# EAGLE design Dig (EAGLE 9.5.1)

## Sheet 1 of 2
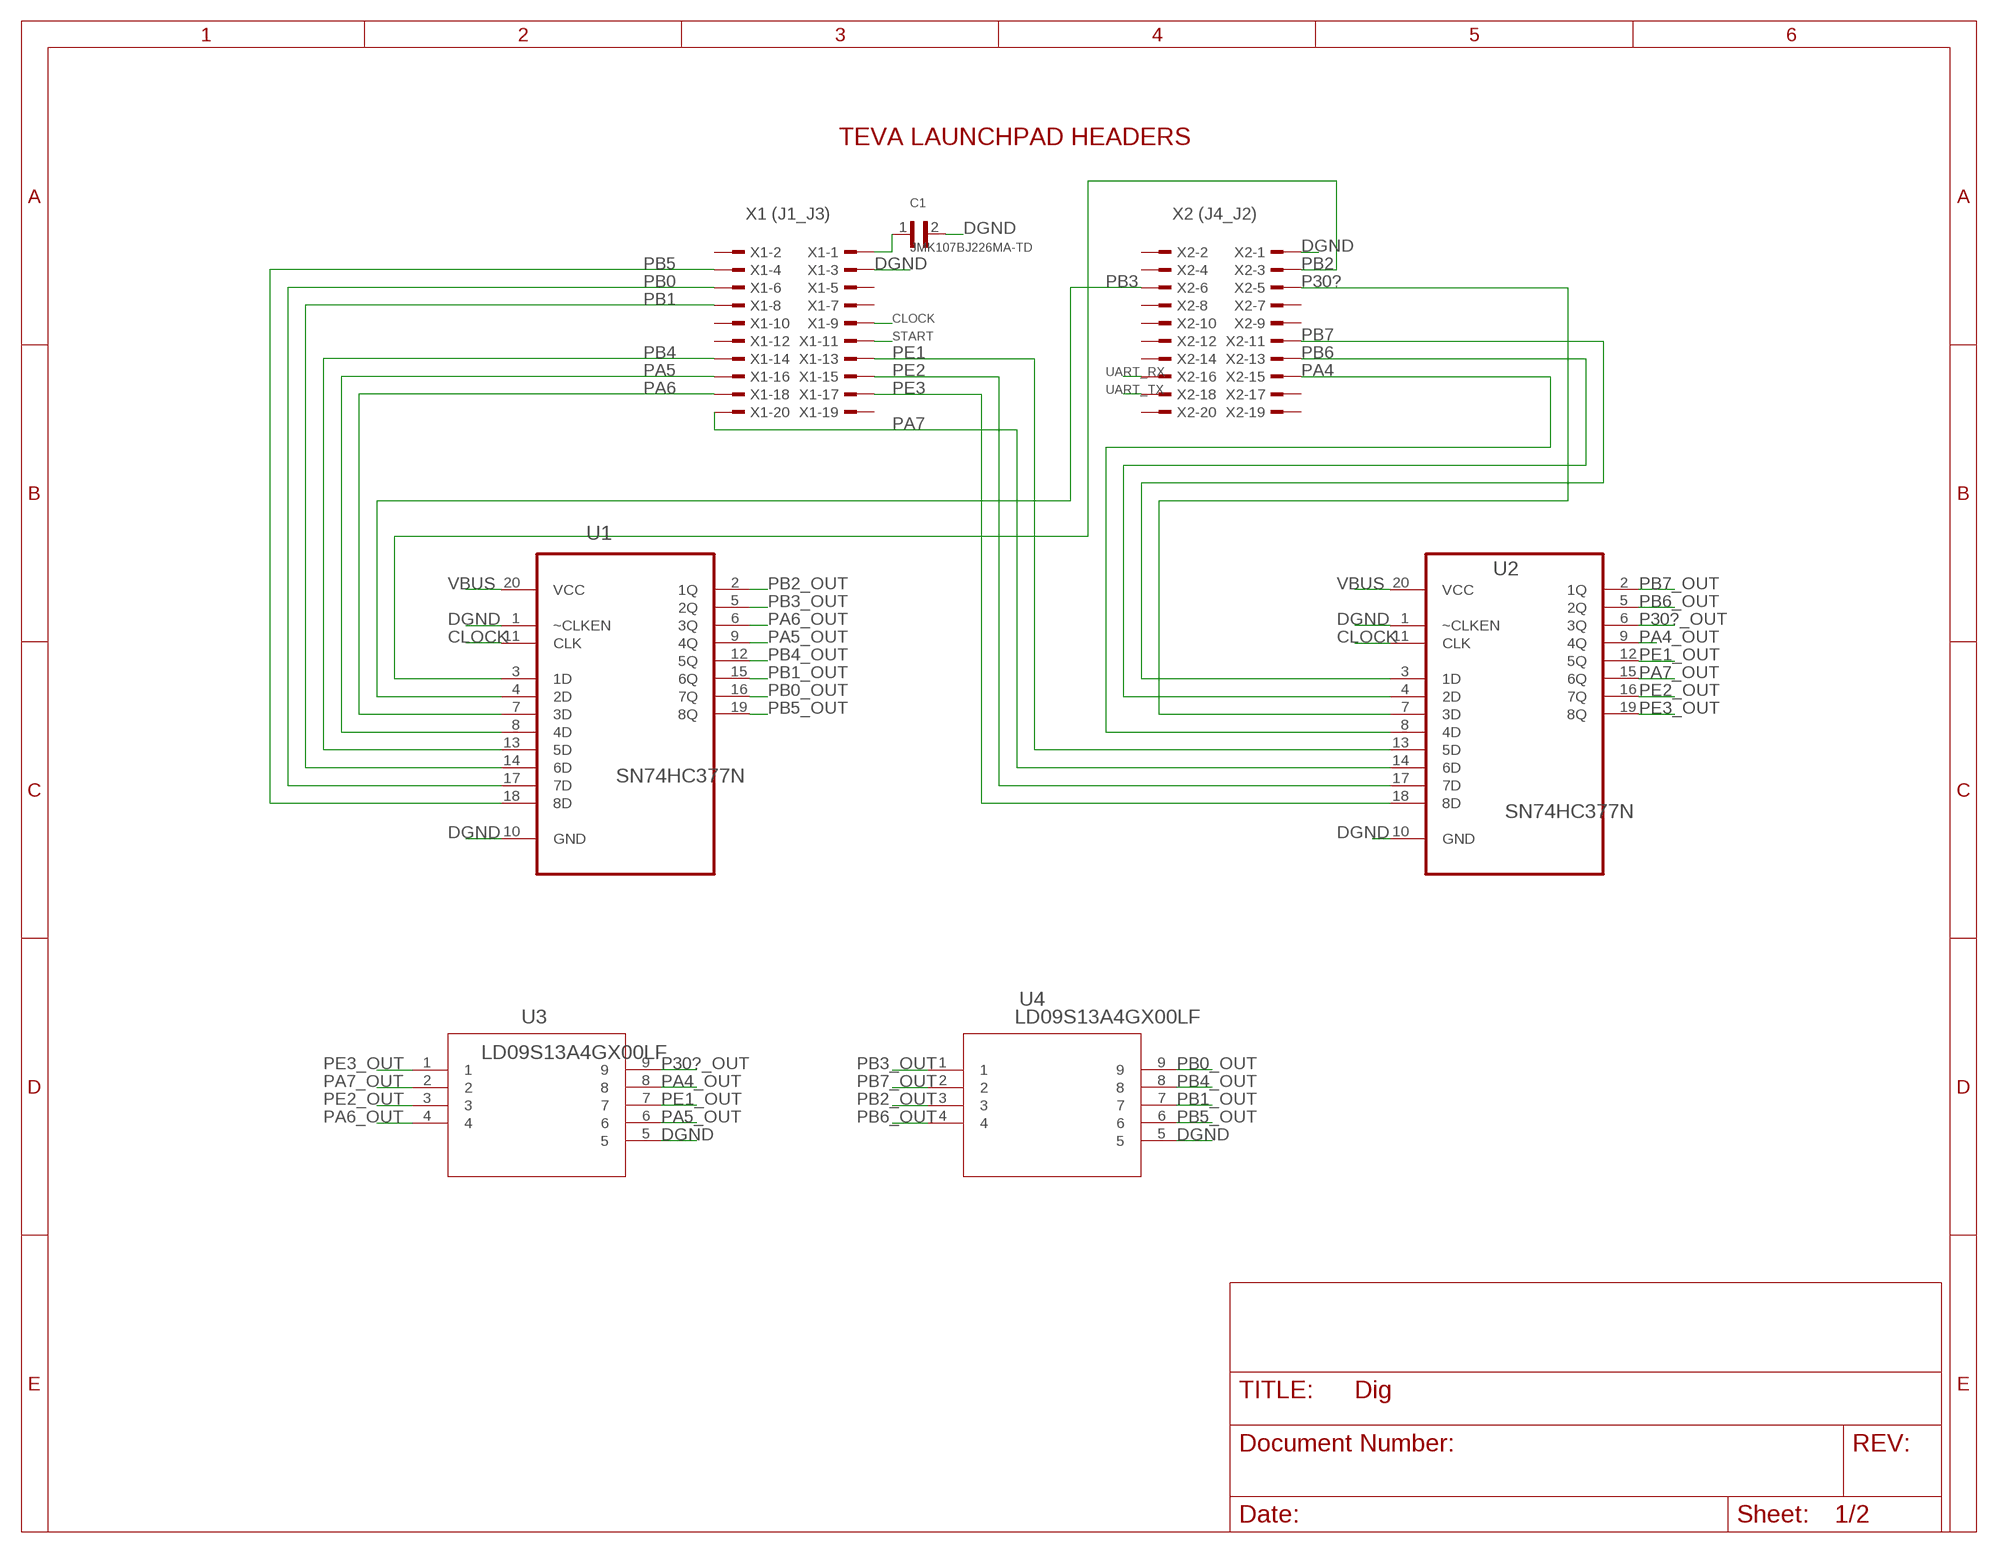
[diagram p0: schematic, sheet 1]

### Parts
C1  JMK107BJ226MA-TD  [CAPC1608X90N]
U1  SN74HC377N  [DIP254P762X508-20]
U2  SN74HC377N  [DIP254P762X508-20]
U3  LD09S13A4GX00LF  [LD09S13A4GX00LF_AMP]
U4  LD09S13A4GX00LF  [LD09S13A4GX00LF_AMP]
X1  X1 (J1_J3)  TSW-110-07-G-D  [TSW-110-XX-G-D]
X2  X2 (J4_J2)  TSW-110-07-G-D  [TSW-110-XX-G-D]

### Nets
CLOCK: U1.11(CLK) U2.11(CLK) X1.9
DGND: C1.2 U1.1(~CLKEN) U1.10(GND) U2.1(~CLKEN) U2.10(GND) U3.5 U4.5 X1.3 X2.1
P30?: U2.7(3D) X2.5
P30?_OUT: U2.6(3Q) U3.9
PA4: U2.8(4D) X2.15
PA4_OUT: U2.9(4Q) U3.8
PA5: U1.8(4D) X1.16
PA5_OUT: U1.9(4Q) U3.6
PA6: U1.7(3D) X1.18
PA6_OUT: U1.6(3Q) U3.4
PA7: U2.14(6D) X1.20
PA7_OUT: U2.15(6Q) U3.2
PB0: U1.17(7D) X1.6
PB0_OUT: U1.16(7Q) U4.9
PB1: U1.14(6D) X1.8
PB1_OUT: U1.15(6Q) U4.7
PB2: U1.3(1D) X2.3
PB2_OUT: U1.2(1Q) U4.3
PB3: U1.4(2D) X2.6
PB3_OUT: U1.5(2Q) U4.1
PB4: U1.13(5D) X1.14
PB4_OUT: U1.12(5Q) U4.8
PB5: U1.18(8D) X1.4
PB5_OUT: U1.19(8Q) U4.6
PB6: U2.4(2D) X2.13
PB6_OUT: U2.5(2Q) U4.4
PB7: U2.3(1D) X2.11
PB7_OUT: U2.2(1Q) U4.2
PE1: U2.13(5D) X1.13
PE1_OUT: U2.12(5Q) U3.7
PE2: U2.17(7D) X1.15
PE2_OUT: U2.16(7Q) U3.3
PE3: U2.18(8D) X1.17
PE3_OUT: U2.19(8Q) U3.1
START: X1.11
UART_RX: X2.16
UART_TX: X2.18
VBUS: C1.1 U1.20(VCC) U2.20(VCC) X1.1
Unconnected: X1.2 X1.5 X1.7 X1.10 X1.12 X1.19 X2.2 X2.4 X2.7 X2.8 X2.9 X2.10 X2.12 X2.14 X2.17 X2.19 X2.20

### Notes on the sheet
- TEVA LAUNCHPAD HEADERS

## Sheet 2 of 2
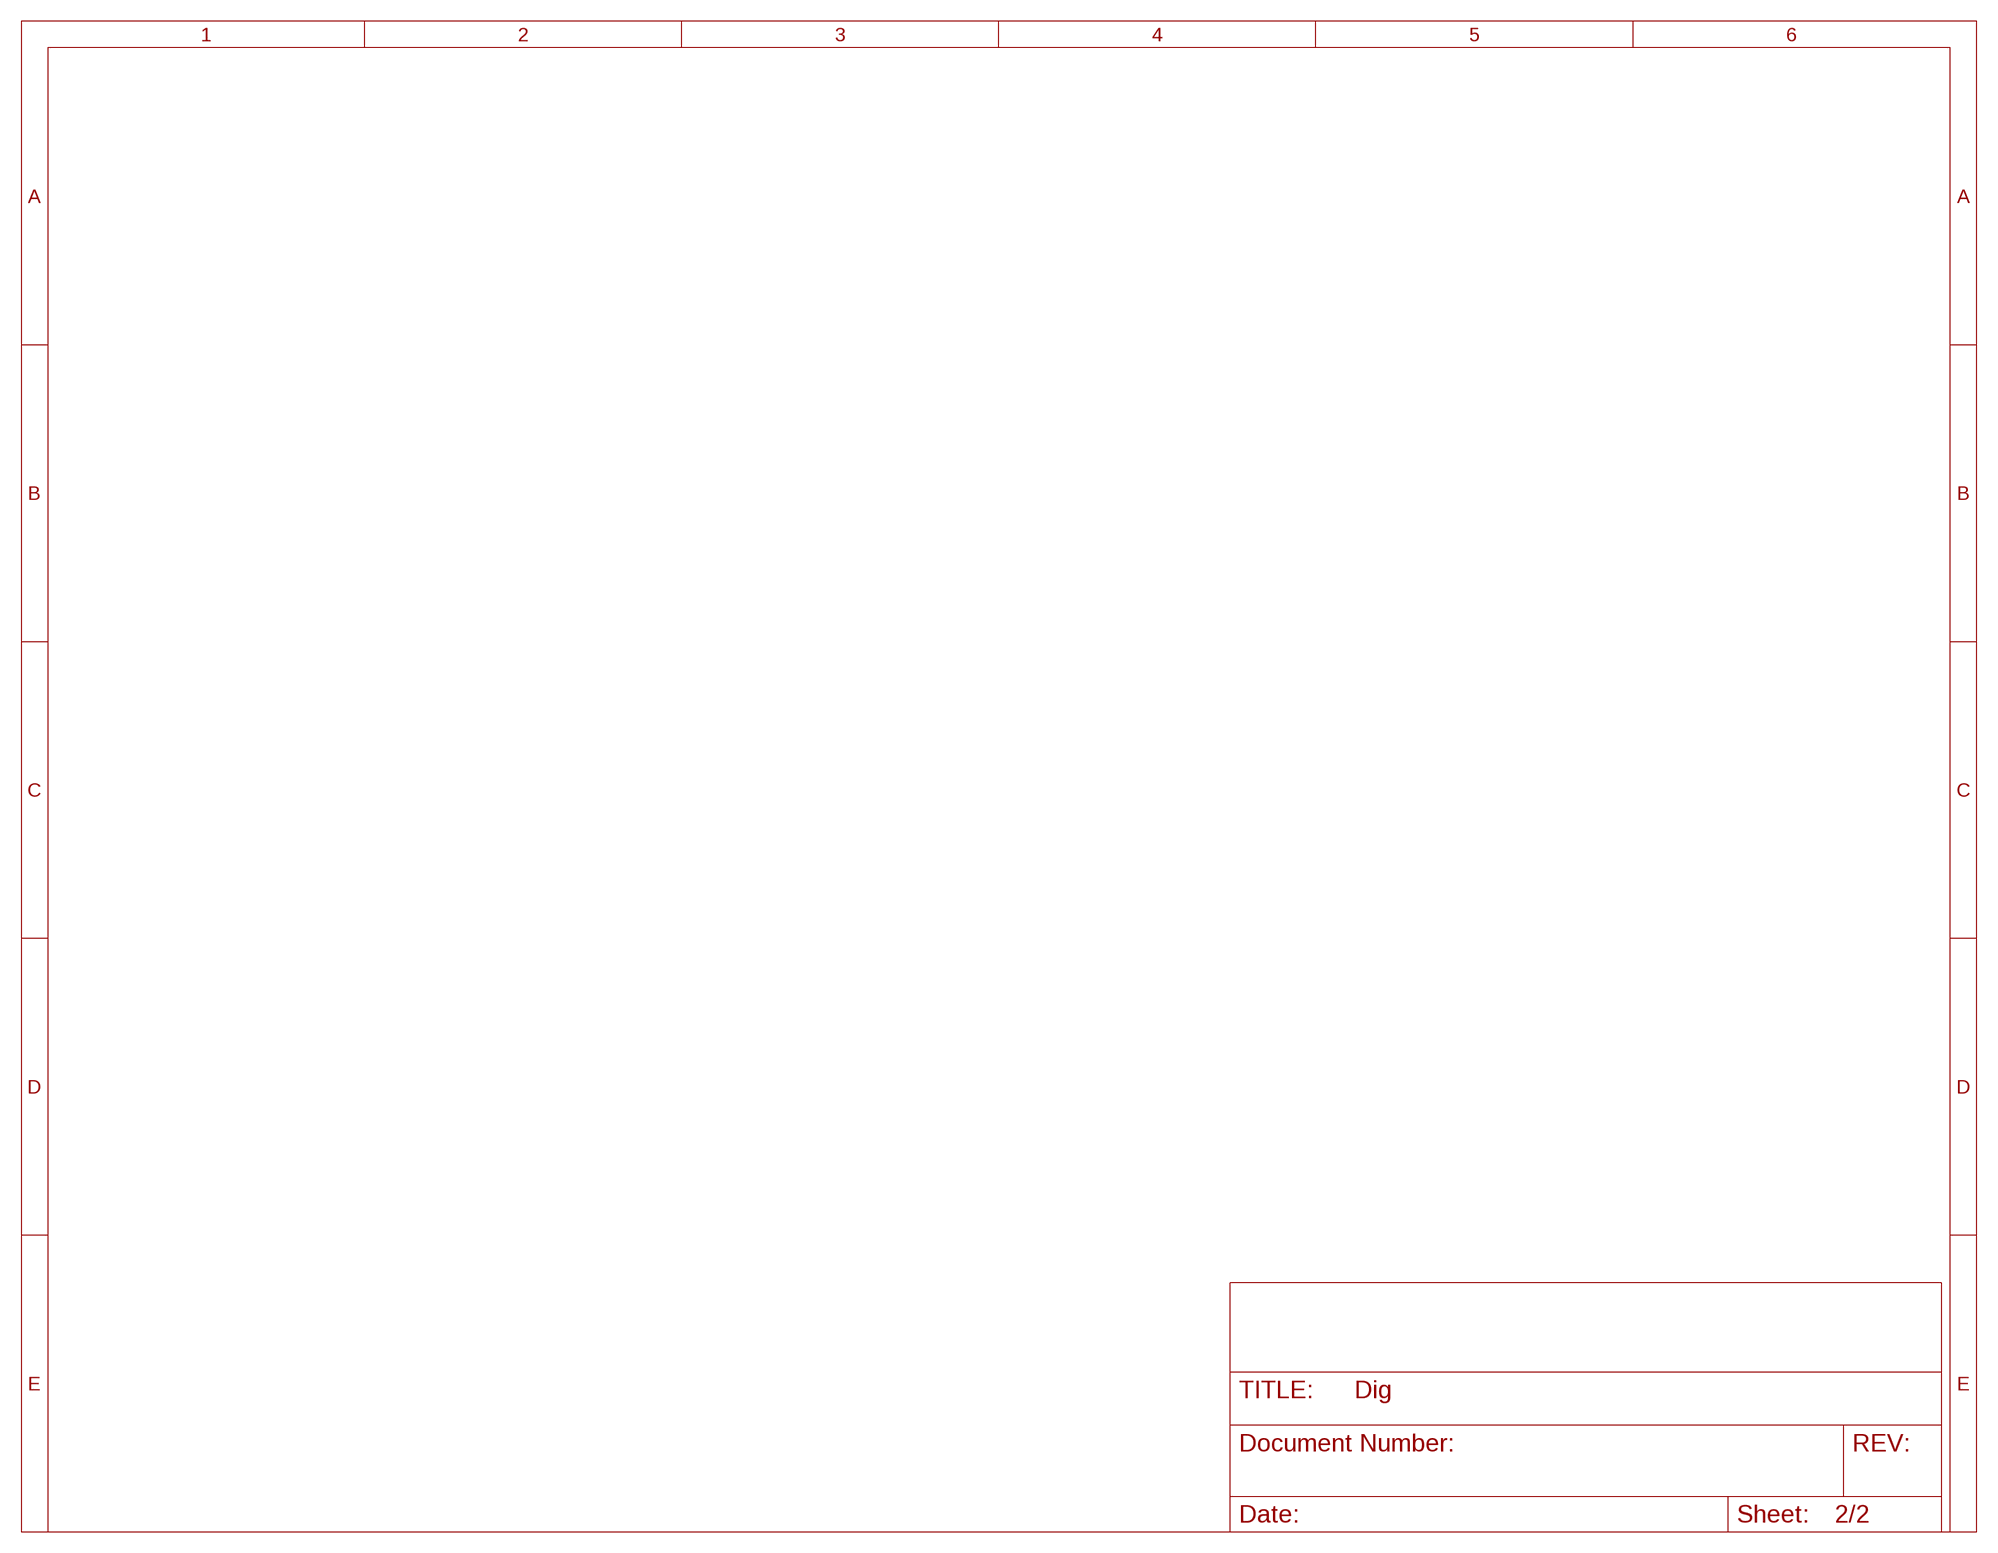
[diagram p1: schematic, sheet 2]

## Library data of the parts
C1 = 22muF_cap_0603:JMK107BJ226MA-TD: CAP CER 22UF 6.3V X5R 0603; DESCRIPTION: 22µF ±20% 6.3V Ceramic Capacitor X5R 0603 (1608 Metric); DIGI-KEY_PART_NUMBER: 587-6144-1-ND; MF: Taiyo Yuden; MP: JMK107BJ226MA-TD; PACKAGE: 1608 Taiyo Yuden
U1 = SN74HC377N:SN74HC377N: OCTAL D -TYPE FLIP-FLOP Check prices <https://pricing.snapeda.com/parts/SN74HC377N/Texas%20Instruments/view-part?ref=eda>; AVAILABILITY: In Stock; DESCRIPTION: Octal D-Type Flip-Flops With Clock Enable 20-PDIP -40 to 85; MF: Texas Instruments; MP: SN74HC377N; PACKAGE: PDIP-20 Texas Instruments; PRICE: None; PURCHASE-URL: https://pricing.snapeda.com/search/part/SN74HC377N/?ref=eda; SPICEPREFIX: U
U2 = SN74HC377N:SN74HC377N: OCTAL D -TYPE FLIP-FLOP Check prices <https://pricing.snapeda.com/parts/SN74HC377N/Texas%20Instruments/view-part?ref=eda>; AVAILABILITY: In Stock; DESCRIPTION: Octal D-Type Flip-Flops With Clock Enable 20-PDIP -40 to 85; MF: Texas Instruments; MP: SN74HC377N; PACKAGE: PDIP-20 Texas Instruments; PRICE: None; PURCHASE-URL: https://pricing.snapeda.com/search/part/SN74HC377N/?ref=eda
U3 = DB9_output:LD09S13A4GX00LF; BUILT_BY: EMA_Colton; COPYRIGHT: Copyright (C) 2018 Accelerated Designs. All rights reserved; DATASHEET: https://www.amphenol-icc.com/media/wysiwyg/files/drawing/10130913.pdf; MANUFACTURER_PART_NUMBER: LD09S13A4GX00LF; SOURCELIBRARY: Add_to_database_2021-03-09; SPICEPREFIX: U; VENDOR: Amphenol
U4 = DB9_output:LD09S13A4GX00LF; BUILT_BY: EMA_Colton; COPYRIGHT: Copyright (C) 2018 Accelerated Designs. All rights reserved; DATASHEET: https://www.amphenol-icc.com/media/wysiwyg/files/drawing/10130913.pdf; MANUFACTURER_PART_NUMBER: LD09S13A4GX00LF; SOURCELIBRARY: Add_to_database_2021-03-09; VENDOR: Amphenol
X1 X2 = con-samtec:TSW-110-*-G: THROUGH-HOLE .025" SQ POST HEADER Source: Samtec TSW.pdf; MF: Samtec Inc.; MPN: TSW-110-07-G-D

## Board
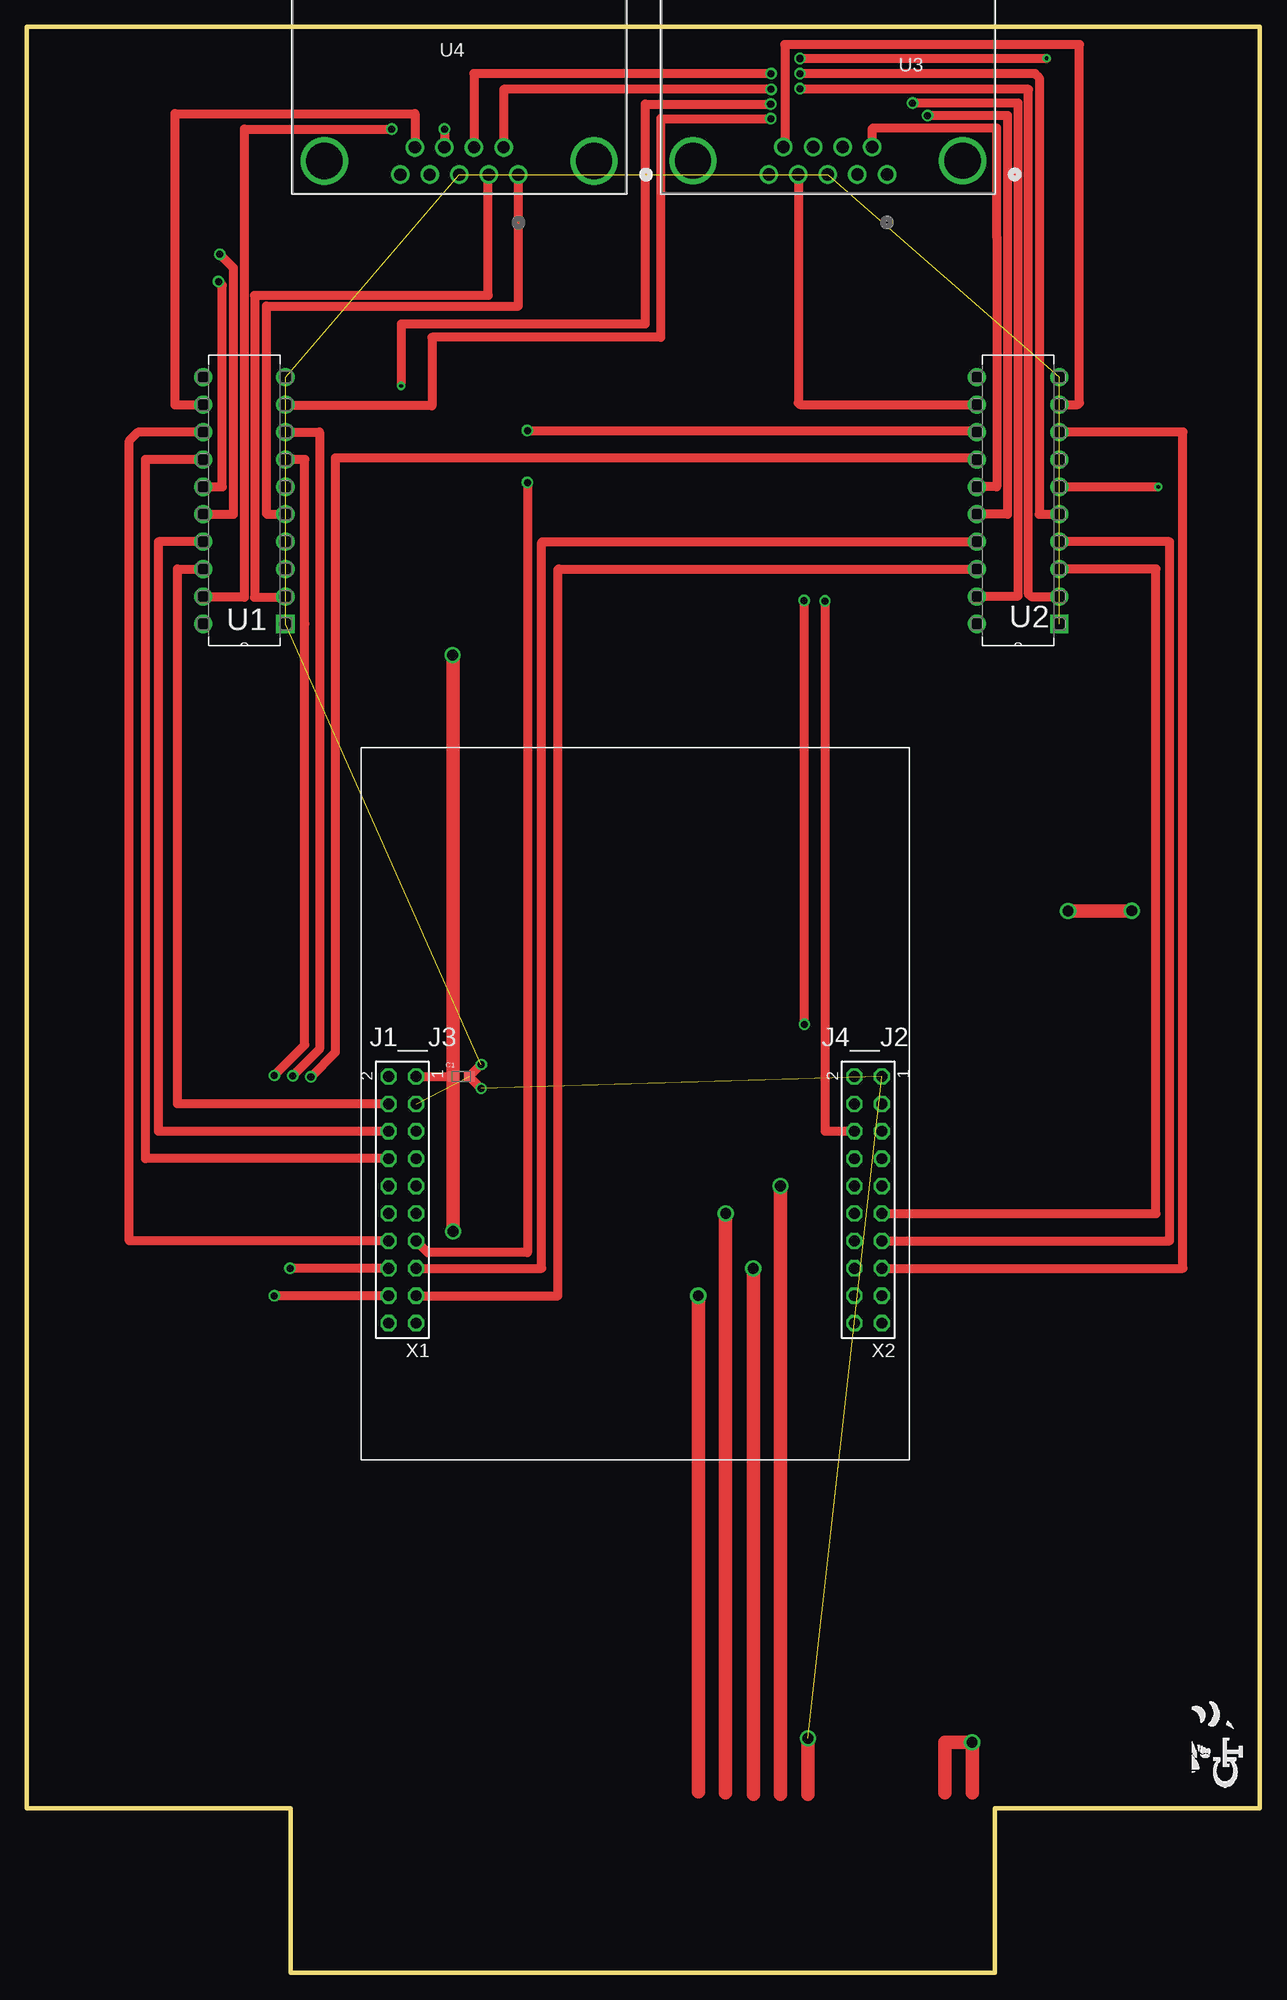
[diagram p2: board, top side]
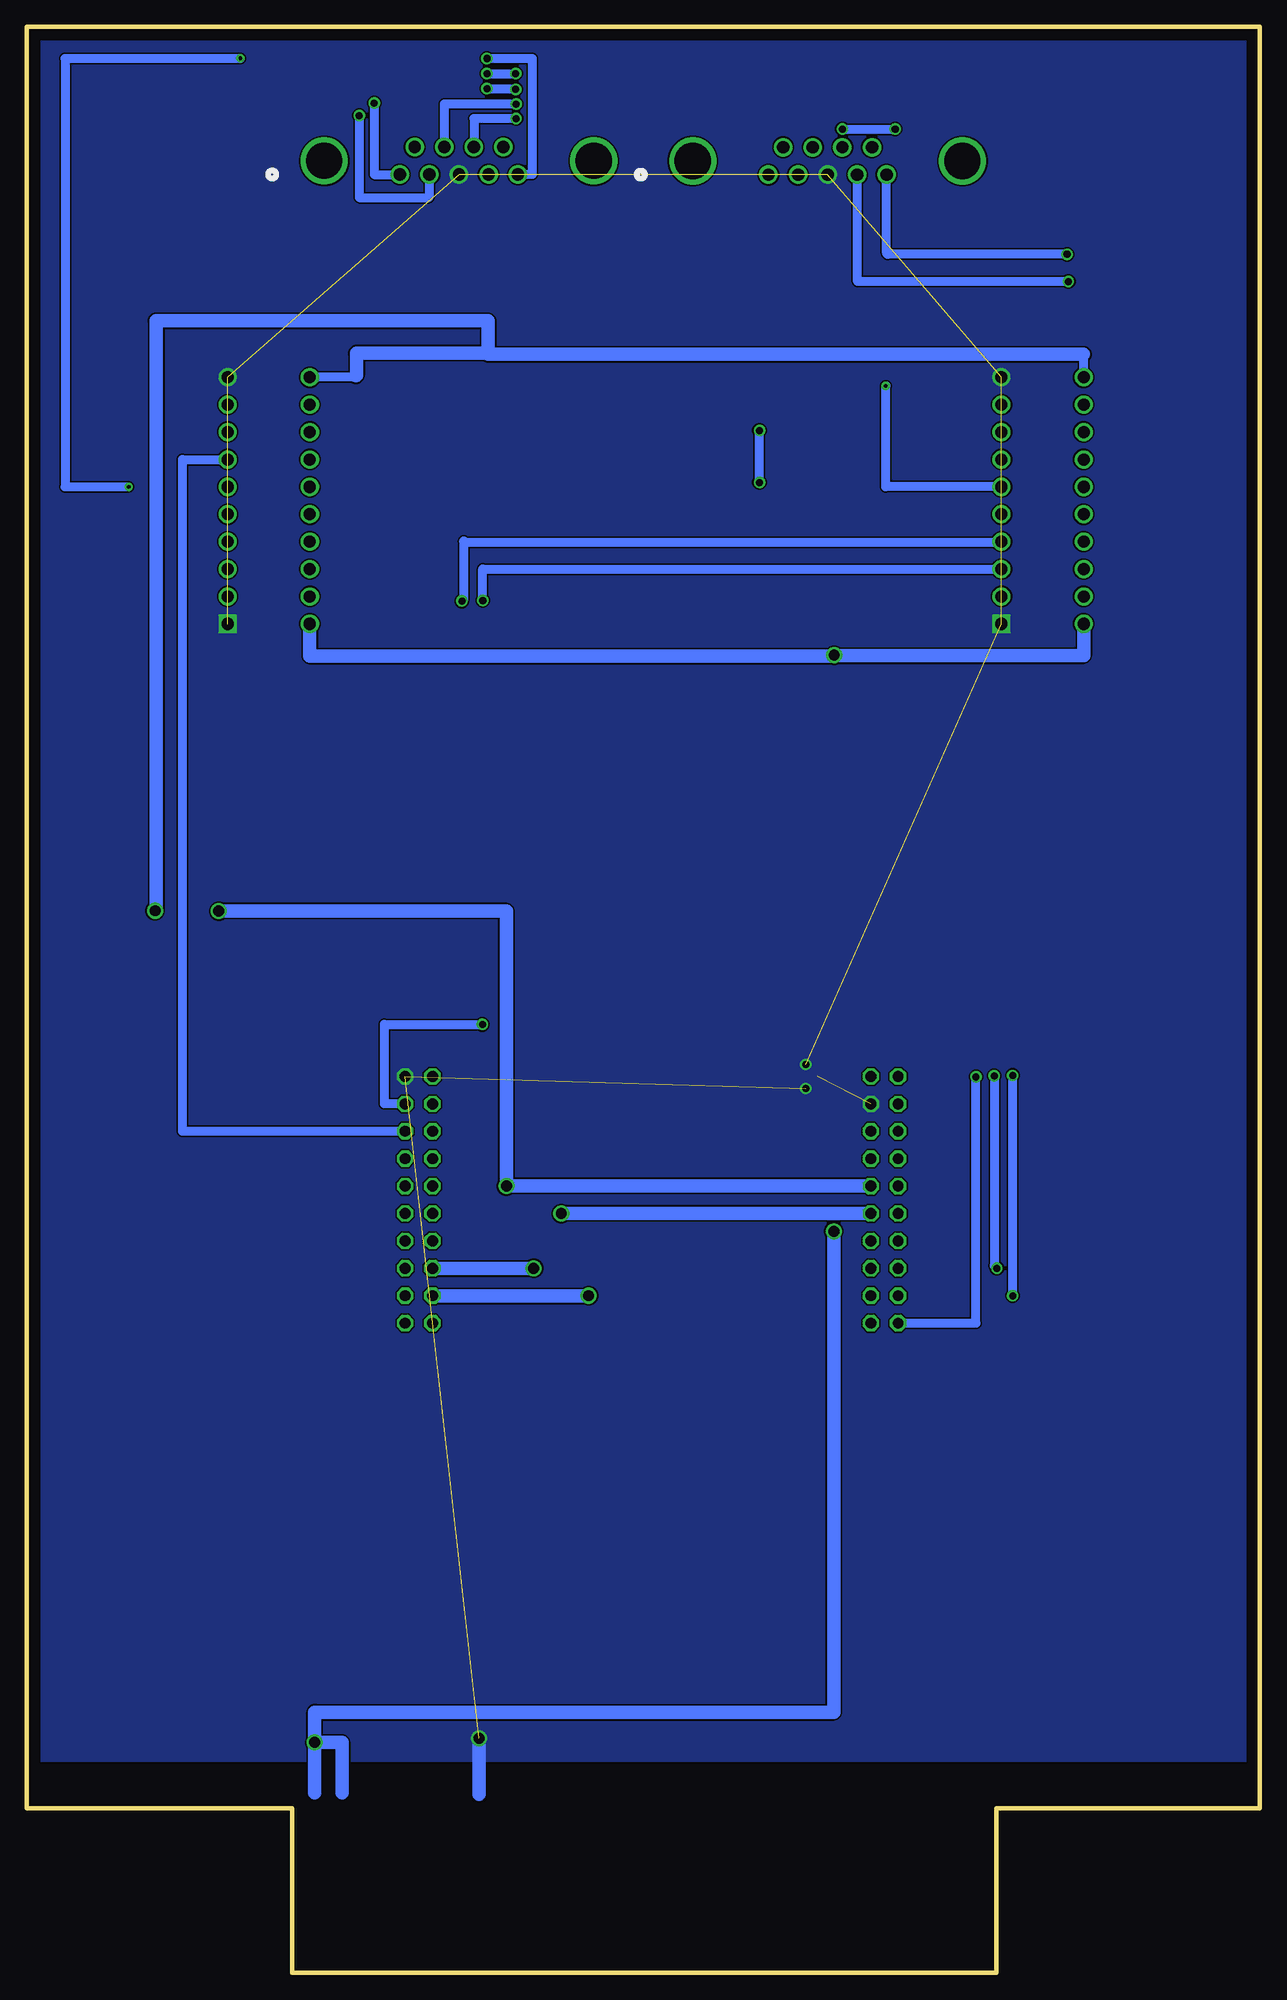
[diagram p3: board, bottom side, seen from below]

Size 114.3 x 180.34 mm. Coordinates in mm from the lower left corner, seen from the top.
Outline: 114.3,180.34 0,180.34 0,15.24 24.45,15.24 24.45,0 89.73,0 89.73,15.24 114.3,15.24 114.3,180.34
Copper layers ([2:[15:1+2*15+16]]): Top 0.01778125mm / dielectric 12mil / Route2 0.01778125mm / dielectric 39mil / Route15 0.01778125mm / dielectric 12mil / Bottom 0.01778125mm
Design rules "default *": minimum track width 6mil, minimum drill 0.35mm, track to track 6mil, track to pad 6mil, pad to pad 6mil, via to via 6mil, smd to smd 6mil, copper to edge 40mil, drill to drill 6mil, minimum pad ring 10mil, minimum via ring 8mil, stop-mask expansion 4mil, vias tented up to drill 0mil, thermal gap 10mil

### Footprints (pad centres in the part's own frame; a part is rotated, then mirrored left to right if it is on the bottom)
CAPC1608X90N = smd 0.95 x 0.93: 1 -0.738,0; 2 0.738,0
DIP254P762X508-20 = drill 1.118 square: 1 -7.62,22.86 | drill 1.118: 2 -7.62,20.32; 3 -7.62,17.78; 4 -7.62,15.24; 5 -7.62,12.7; 6 -7.62,10.16; 7 -7.62,7.62; 8 -7.62,5.08; 9 -7.62,2.54; 10 -7.62,0; 11 0,0; 12 0,2.54; 13 0,5.08; 14 0,7.62; 15 0,10.16; 16 0,12.7; 17 0,15.24; 18 0,17.78; 19 0,20.32; 20 0,22.86
LD09S13A4GX00LF_AMP = drill 1.143 pad 1.651: 1 0,0; 2 1.372,-2.54; 3 2.743,0; 4 4.115,-2.54; 5 5.486,0; 6 6.858,-2.54; 7 8.23,0; 8 9.601,-2.54; 9 10.947,0 | drill 3.353 pad 3.861: 10 -7.01,-1.27; 11 17.983,-1.27
TSW-110-XX-G-D = drill 1 pad 1.5 octagon: 1 11.43,-1.27; 2 11.43,1.27; 3 8.89,-1.27; 4 8.89,1.27; 5 6.35,-1.27; 6 6.35,1.27; 7 3.81,-1.27; 8 3.81,1.27; 9 1.27,-1.27; 10 1.27,1.27; 11 -1.27,-1.27; 12 -1.27,1.27; 13 -3.81,-1.27; 14 -3.81,1.27; 15 -6.35,-1.27; 16 -6.35,1.27; 17 -8.89,-1.27; 18 -8.89,1.27; 19 -11.43,-1.27; 20 -11.43,1.27

### Placement (x,y rotation side)
C1  40.26,83.06 0 top
U1  16.34,147.87 180 top
U2  88.08,147.87 180 top
U3  79.73,166.67 180 top
U4  45.56,166.65 180 top
X1  34.8,71.63 90 top
X2  77.98,71.63 90 top

### Tracks (layer width: path | path; a pad name or v marks a point on that pad's centre or on a via)
CLOCK  (via drill 1)
  Top 1.27: 69.85,16.51 v69.85,72.9 | v96.52,98.39 102.39,98.39 v102.43,98.42
  Bottom 0.152: U1.11 16.36,147.89 | 83.76,148.05 83.93,147.87
  Bottom 0.813: 16.36,150.01 16.36,147.89 | 83.93,147.87 U2.11
  Bottom 1.27: X1.9 v69.85,72.9 69.85,98.39 v96.52,98.39 | v102.43,98.42 102.33,98.52 102.33,153.1 71.57,153.1 71.53,153.07 71.53,150.11 | 71.53,150.11 71.53,150.01 16.36,150.01 | 71.53,150.11 83.72,150.11 83.76,150.08 83.76,148.05 83.79,148.02
DGND  (via drill 0.65, 1)  (9 unrouted)
  Top 0.813: v42.11,84.17 C1.2 41.03,83.03 41.03,83.02 v42.1,81.95
  Top 1.27: v72.39,21.72 72.39,16.51
  Bottom 1.27: v72.39,21.72 72.39,16.51
  pour Bottom (no thermals): 113.28,19.62 113.28,179.45 0.56,179.45 0.95,19.56
P30?
  Bottom 0.152: U2.7
  Bottom 0.813: X2.5 99.87,77.98 99.87,140.25 U2.7
P30?_OUT  (via drill 0.35, 0.65)
  Top 0.152: 104.85,137.71 104.86,137.72 v104.87,137.71
  Top 0.813: v71.66,177.42 71.79,177.42 71.8,177.43 v94.52,177.43 | U2.6 104.85,137.71
  Bottom 0.152: 104.89,137.72 v104.87,137.71
  Bottom 0.813: v71.66,177.42 67.47,177.42 67.47,166.67 U3.9 | v94.52,177.43 110.77,177.43 110.77,137.72 104.89,137.72
PA4
  Top 0.152: U2.8
  Top 0.813: X2.15 107.16,65.28 107.16,142.8 97.18,142.8 U2.8
PA4_OUT
  Top 0.152: 97.42,145.33 97.57,145.48
  Top 0.813: U3.8 70.26,169.34 70.26,178.71 97.57,178.71 97.57,145.48 | U2.9 97.42,145.33
PA5  (via drill 0.65)
  Top 0.152: U1.8
  Top 0.813: v24.64,83.12 27.12,85.6 27.12,142.79 U1.8 | X1.16 v24.38,65.28
  Bottom 0.813: v24.64,83.12 24.64,65.53 v24.38,65.28
PA5_OUT  (via drill 0.65)
  Top 0.152: 24.07,145.22 U1.9
  Top 0.813: v68.95,171.85 58.77,171.85 58.77,151.57 37.55,151.57 37.55,145.22 24.07,145.22
  Bottom 0.813: v68.95,171.85 72.87,171.85 U3.6
PA6  (via drill 0.65)
  Top 0.813: X1.18 v22.92,62.74 | v22.92,83.15 25.76,85.99 25.76,125.02 25.76,140.26 U1.7
  Bottom 0.813: v22.92,62.74 v22.92,83.15
PA6_OUT  (via drill 0.35, 0.65)
  Top 0.152: 34.7,147.4 v34.7,147.07
  Top 0.813: v68.95,173.19 57.34,173.19 57.34,152.8 34.7,152.8 34.7,147.4
  Bottom 0.813: v68.95,173.19 75.62,173.19 U3.4 | 34.67,147.05 v34.7,147.07 34.7,137.71 U1.6
PA7  (via drill 0.65)
  Top 0.152: 87.93,140.4 U2.14
  Top 0.813: v26.32,83.03 28.61,85.31 28.61,140.4 87.93,140.4
  Bottom 0.813: X1.20 26.32,60.2 v26.32,83.03
PA7_OUT
  Top 0.152: 89.91,137.72 89.91,137.71
  Top 0.813: 89.91,137.72 89.91,160.9 89.91,160.89 89.91,170.96 78.44,170.96 78.36,170.88 U3.2 | 89.91,137.71 U2.15
PB0
  Top 0.152: U1.17
  Top 0.813: X1.6 12.2,77.98 12.2,132.63 U1.17
PB0_OUT  (via drill 0.65)
  Top 0.152: 19.12,135.17 19.14,135.15
  Top 0.813: v17.88,159.26 19.14,157.99 19.14,135.15 | U1.16 19.12,135.17
  Bottom 0.813: v17.88,159.26 34.51,159.26 34.61,159.36 U4.9
PB1
  Top 0.152: 16.32,140.27 U1.14
  Top 0.813: X1.8 11,75.44 11,140.27 16.32,140.27
PB1_OUT  (via drill 0.65)
  Top 0.152: 18.11,137.71 18.11,137.72
  Top 0.813: v17.76,156.74 18.11,156.39 18.11,137.72 | U1.15 18.11,137.71
  Bottom 0.813: v17.76,156.74 37.31,156.74 37.31,166.63 U4.7
PB2  (via drill 0.65)
  Top 0.813: v72.07,87.88 72.07,127.16 v72.04,127.19
  Bottom 0.813: X2.3 81.15,80.52 81.15,87.88 v72.07,87.88 | v72.04,127.19 72.04,130.09 U1.3
PB2_OUT
  Top 0.152: 23.89,127.48 U1.2
  Top 0.813: U4.3 42.77,166.6 42.77,155.47 21.1,155.47 21.1,127.48 23.89,127.48
PB3  (via drill 0.65)
  Top 0.813: X2.6 73.98,77.98 v73.98,127.13
  Bottom 0.152: 24,132.59 U1.4
  Bottom 0.813: 73.82,132.59 73.82,127.29 v73.98,127.13 | 73.82,132.59 73.82,132.72 | 73.82,132.59 24,132.59
PB3_OUT
  Top 0.152: 22.19,135.26 22.28,135.17
  Top 0.813: 22.19,135.26 22.19,154.47 45.56,154.47 U4.1 | 22.28,135.17 U1.5
PB4
  Top 0.152: U1.13 16.32,142.77
  Top 0.813: X1.14 9.49,67.82 9.49,141.98 10.29,142.77 16.32,142.77
PB4_OUT
  Top 0.152: U1.12
  Top 0.813: U4.8 35.96,172.3 13.72,172.3 13.72,145.33 U1.12
PB5
  Top 0.152: U1.18
  Top 0.813: X1.4 13.95,80.52 13.95,130.1 U1.18
PB5_OUT  (via drill 0.65)
  Top 0.152: 16.41,127.48 U1.19
  Top 0.813: v38.7,170.88 U4.6 | v33.81,170.88 20.14,170.88 20.14,127.48 16.41,127.48
  Bottom 0.813: v38.7,170.88 v33.81,170.88
PB6
  Top 0.152: 105.93,132.62 105.91,132.63
  Top 0.813: X2.13 105.93,67.82 105.93,132.62 | 105.91,132.63 U2.4
PB6_OUT  (via drill 0.65)
  Top 0.152: U2.5
  Top 0.813: v71.66,176.02 93.44,176.02 93.85,175.61 93.85,135.16 U2.5 | v68.99,176.02 41.45,176.02 U4.4
  Bottom 0.813: v71.66,176.02 v68.99,176.02
PB7
  Top 0.152: 104.66,130.09 104.65,130.09
  Top 0.813: X2.11 104.66,70.36 104.66,130.09 | 104.65,130.09 U2.3
PB7_OUT  (via drill 0.65)
  Top 0.152: 92.85,127.77 93.07,127.55
  Top 0.813: 92.85,127.77 92.85,174.56 71.72,174.56 v71.66,174.62 | v68.99,174.56 44.19,174.56 U4.2 | 93.07,127.55 U2.2
  Bottom 0.813: v71.66,174.62 71.66,174.56 v68.99,174.56
PE1  (via drill 0.65)
  Top 0.152: 87.93,142.94 U2.13
  Top 0.813: X1.13 37.15,66.74 46.39,66.74 v46.39,138.11 | v46.39,142.94 87.93,142.94
  Bottom 0.813: v46.39,138.11 v46.39,142.94
PE1_OUT
  Top 0.152: 71.5,145.48 71.65,145.33
  Top 0.813: U3.7 71.5,145.48 | 71.65,145.33 U2.12
PE2
  Top 0.152: 47.71,132.55 47.79,132.63
  Top 0.813: X1.15 47.71,65.28 47.71,132.55 | 47.79,132.63 U2.17
PE2_OUT  (via drill 0.65)
  Top 0.152: 90.91,135.18 90.9,135.17
  Top 0.813: 90.91,135.18 90.91,172.14 v83.5,172.14 | 90.9,135.17 U2.16
  Bottom 0.813: v83.5,172.14 83.5,164.52 77.05,164.52 77.05,166.61 U3.3
PE3
  Top 0.152: 49.21,130.01 49.29,130.09
  Top 0.813: 49.21,130.01 49.21,62.74 X1.17 | 49.29,130.09 U2.18
PE3_OUT  (via drill 0.65)
  Top 0.152: 91.88,127.62 91.81,127.55
  Top 0.813: 91.88,127.62 91.88,173.28 v82.1,173.28 | 91.81,127.55 U2.19
  Bottom 0.813: v82.1,173.28 82.1,166.67 U3.1
START  (via drill 1)
  Top 1.27: v64.77,70.36 64.77,60.96 64.77,16.66
  Bottom 1.27: X1.11 v64.77,70.36
UART_RX  (via drill 1)
  Top 1.27: v67.34,65.28 67.34,16.53
  Bottom 1.27: X2.16 v67.34,65.28
UART_TX  (via drill 1)
  Top 1.27: v62.23,62.74 62.23,16.76
  Bottom 1.27: X2.18 v62.23,62.74
VBUS  (via drill 1)
  Top 0.813: X1.1 C1.1
  Top 1.27: 85.09,16.64 85.09,21.34 v87.63,21.34 87.63,16.64 | v39.47,122.11 39.49,122.09 39.49,83.09 C1.1 39.52,68.71 v39.5,68.71
  Bottom 0.152: U2.20
  Bottom 1.27: v87.63,21.34 85.09,21.34 85.09,16.64 | v87.63,21.34 87.63,16.64 | v87.63,21.34 87.63,24.13 39.5,24.13 v39.5,68.71 | U1.20 16.34,122.09 39.44,122.09 v39.47,122.11 39.54,122.04 88.08,122.04 U2.20

### Text on the board
tNames: J1__J3 | J4__J2